# Altium schematic sheet buckboost.SchDoc
size B
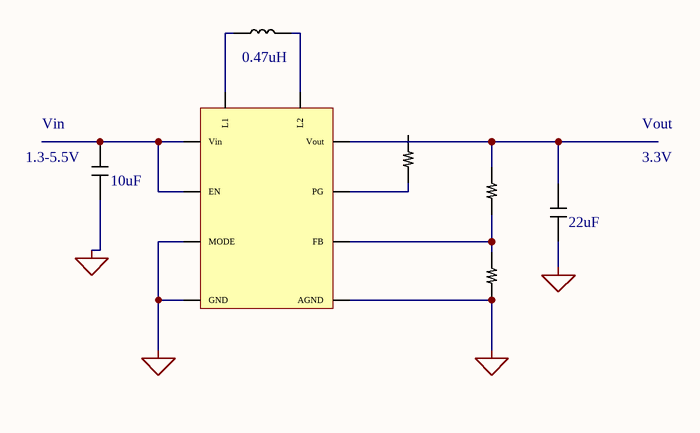
[diagram p0: buckboost.SchDoc]

## Parts
*  TPS63802  [TPS63802]  (value not drawn)
C1  10uF  [cap]
C2  22uF  [cap]
L  0.47uH  [coil]
r1  resistor  [resistor]  (value not drawn)
R2  resistor  [resistor]  (value not drawn)
R3  resistor  [resistor]  (value not drawn)

## Nets
GND: *.2(MODE) *.3(AGND) *.8(GND) C1.2 C2.1 R3.1
Net*_1: *.1(EN) *.10(Vin) C1.1
Net*_4: *.4(FB) R2.2 R3.2
Net*_5: *.5(PG) r1.1
Net*_6: *.6(Vout) C2.2 R2.1
Net*_7: *.7(L2) L.2
Net*_9: *.9(L1) L.1

Not connected (* = marked no-connect by the designer): r1 2

## Notes on the sheet
- (near C1) 1.3-5.5V
- (near C1) Vin
- Vout
- 3.3V

## Library data of the parts
C1 C2 = cap
L = coil